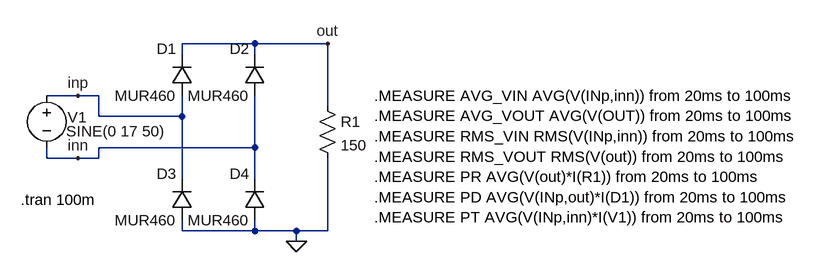
[diagram p0: schematic redressement double_diode.asc]
redressement double_diode.asc, the LTspice schematic file:
Version 4
SHEET 1 956 680
WIRE 16 32 -96 32
WIRE 128 32 16 32
WIRE -96 48 -96 32
WIRE 16 48 16 32
WIRE -256 112 -304 112
WIRE -224 112 -256 112
WIRE 128 128 128 32
WIRE -224 144 -224 112
WIRE -96 144 -96 112
WIRE -96 144 -224 144
WIRE 16 192 16 112
WIRE 16 192 -224 192
WIRE -304 208 -304 192
WIRE -256 208 -304 208
WIRE -224 208 -224 192
WIRE -224 208 -256 208
WIRE -96 240 -96 144
WIRE 16 240 16 192
WIRE -96 320 -96 304
WIRE 16 320 16 304
WIRE 16 320 -96 320
WIRE 80 320 16 320
WIRE 128 320 128 208
WIRE 128 320 80 320
WIRE 80 336 80 320
FLAG -256 112 inp
FLAG 128 32 out
FLAG 80 336 0
FLAG -256 208 inn
SYMBOL voltage -304 96 R0
WINDOW 3 30 71 Left 2
WINDOW 123 0 0 Left 2
WINDOW 39 0 0 Left 2
WINDOW 0 32 49 Left 2
SYMATTR Value SINE(0 17 50)
SYMATTR InstName V1
SYMBOL res 112 112 R0
SYMATTR InstName R1
SYMATTR Value 150
SYMBOL diode -80 112 R180
WINDOW 0 24 72 Left 2
WINDOW 3 24 0 Left 2
SYMATTR InstName D1
SYMATTR Value MUR460
SYMBOL diode 32 112 R180
WINDOW 0 24 72 Left 2
WINDOW 3 24 0 Left 2
SYMATTR InstName D2
SYMATTR Value MUR460
SYMBOL diode -80 304 R180
WINDOW 0 24 72 Left 2
WINDOW 3 24 0 Left 2
SYMATTR InstName D3
SYMATTR Value MUR460
SYMBOL diode 32 304 R180
WINDOW 0 24 72 Left 2
WINDOW 3 24 0 Left 2
SYMATTR InstName D4
SYMATTR Value MUR460
TEXT -344 272 Left 2 !.tran 100m
TEXT 200 112 Left 2 !.MEASURE AVG_VIN AVG(V(INp,inn)) from 20ms to 100ms\n.MEASURE AVG_VOUT AVG(V(OUT)) from 20ms to 100ms\n.MEASURE RMS_VIN RMS(V(INp,inn)) from 20ms to 100ms\n.MEASURE RMS_VOUT RMS(V(out)) from 20ms to 100ms\n.MEASURE PR AVG(V(out)*I(R1)) from 20ms to 100ms\n.MEASURE PD AVG(V(INp,out)*I(D1)) from 20ms to 100ms\n.MEASURE PT AVG(V(INp,inn)*I(V1)) from 20ms to 100ms

The netlist it stands for:
* redressement double_diode.asc
V1 inp inn SINE(0 17 50)
R1 out 0 150
D1 inp out MUR460
D2 inn out MUR460
D3 0 inp MUR460
D4 0 inn MUR460
.model D D
.lib standard.dio
.tran 100m
.MEASURE AVG_VIN AVG(V(INp,inn)) from 20ms to 100ms
.MEASURE AVG_VOUT AVG(V(OUT)) from 20ms to 100ms
.MEASURE RMS_VIN RMS(V(INp,inn)) from 20ms to 100ms
.MEASURE RMS_VOUT RMS(V(out)) from 20ms to 100ms
.MEASURE PR AVG(V(out)*I(R1)) from 20ms to 100ms
.MEASURE PD AVG(V(INp,out)*I(D1)) from 20ms to 100ms
.MEASURE PT AVG(V(INp,inn)*I(V1)) from 20ms to 100ms
.backanno
.end